# Altium project PCB_One.PrjPCB
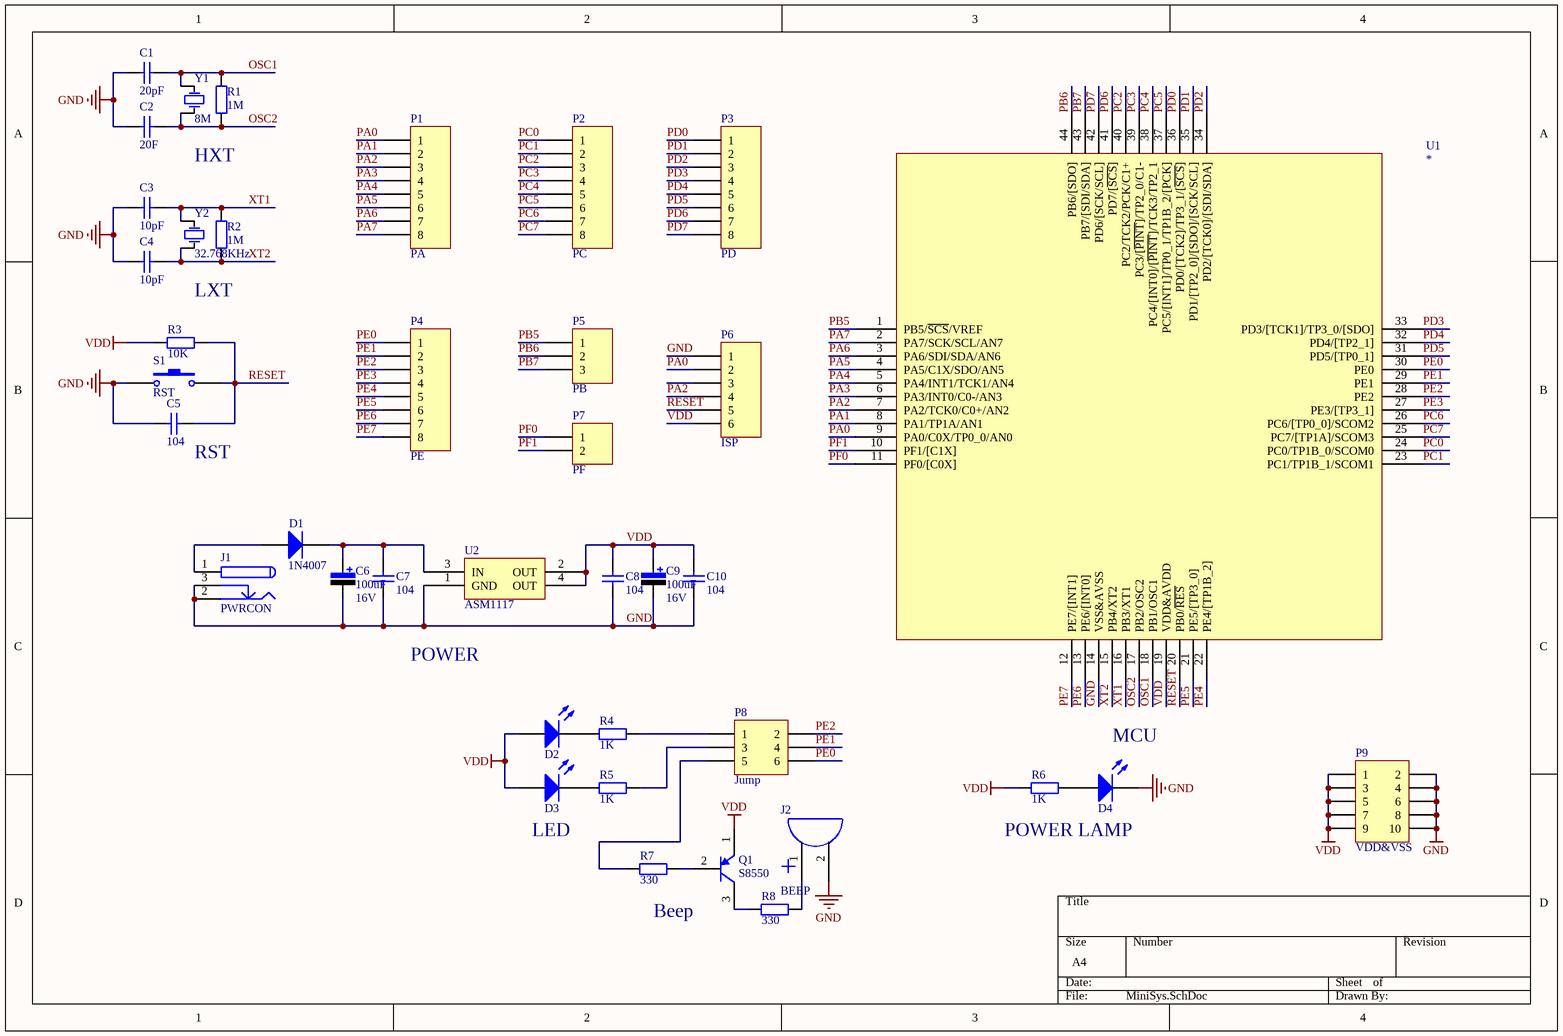
[diagram p0: MiniSys.SchDoc]
1 sheet, 39 parts. Net scope: global (net labels, ports and power ports of the same name join across sheets).
Board file: MiniSys.PcbDoc

## Sheet MiniSys.SchDoc
size A4

### Parts
C1  value 20pF  [C-RAD-0805]  (hidden comment: Cap)
C2  value 20F  [C-RAD-0805]  (hidden comment: Cap)
C3  value 10pF  [C-RAD-0805]  (hidden comment: Cap)
C4  value 10pF  [C-RAD-0805]  (hidden comment: Cap)
C5  value 104  [C-RAD-0805]  (hidden comment: Cap)
C6  value 100uF  Vol: 16V  [RB.1/.2]  (hidden comment: Cap Pol)
C7  value 104  [C-RAD-0805]  (hidden comment: Cap)
C8  value 104  [C-RAD-0805]  (hidden comment: Cap)
C9  value 100uF  Vol: 16V  [RB.1/.2]  (hidden comment: Cap Pol)
C10  value 104  [C-RAD-0805]  (hidden comment: Cap)
D1  Type: 1N4007  [DIODE-AXL]  (hidden comment: Diode)
D2  LED0  [LED_0805]  (value not drawn)
D3  LED0  [LED_0805]  (value not drawn)
D4  LED0  [LED_0805]  (value not drawn)
J1  PWRCON  [DC-005]
J2  BEEP  [Beep]
P1  PA  [HDR1X8]
P2  PC  [HDR1X8]
P3  PD  [HDR1X8]
P4  PE  [HDR1X8]
P5  PB  [HDR3X1_A]
P6  ISP  [HDR1X6]
P7  PF  [HDR2X1_A]
P8  Jump  [HDR2X3]
P9  VDD&VSS  [HDR5X2_A1]
Q1  S8550  [TO-92A]
R1  value 1M  [0805-1]  (hidden comment: Res1)
R2  value 1M  [0805-1]  (hidden comment: Res1)
R3  value 10K  [0805-1]  (hidden comment: Res1)
R4  value 1K  [0805-1]  (hidden comment: Res1)
R5  value 1K  [0805-1]  (hidden comment: Res1)
R6  value 1K  [0805-1]  (hidden comment: Res1)
R7  value 330  [0805-1]  (hidden comment: Res1)
R8  value 330  [0805-1]  (hidden comment: Res1)
S1  RST  [BUTTON]
U1  *
U2  ASM1117  [SOT-223]
Y1  value 8M  [X-HC49U]  (hidden comment: XTAL)
Y2  value 32.768KHz  [X-TC15]  (hidden comment: XTAL)

### Nets
GND: C1.2 C2.2 C3.2 C4.2 C5.1 C6.2 C7.1 C8.1 C9.2 C10.1 D4.2(K) J1.2 J1.3 J2.2 P6.1 P9.2 P9.4 P9.6 P9.8 P9.10 S1.1 U1.14(VSS&AVSS) U2.1(GND)
VDD: C8.2 C9.1 C10.2 D2.1(A) D3.1(A) P6.6 P9.1 P9.3 P9.5 P9.7 P9.9 Q1.1(E) R3.1 R6.1 U1.19(VDD&AVDD) U2.2(OUT) U2.4(OUT)
OSC1: C1.1 R1.1 U1.18(PB1/OSC1) Y1.1(OSC1)
OSC2: C2.1 R1.2 U1.17(PB2/OSC2) Y1.2(OSC2)
PA0: P1.1 P6.2 U1.9(PA0/C0X/TP0_0/AN0)
PA1: P1.2 U1.8(PA1/TP1A/AN1)
PA2: P1.3 P6.4 U1.7(PA2/TCK0/C0+/AN2)
PA3: P1.4 U1.6(PA3/INT0/C0-/AN3)
PA4: P1.5 U1.5(PA4/INT1/TCK1/AN4)
PA5: P1.6 U1.4(PA5/C1X/SDO/AN5)
PA6: P1.7 U1.3(PA6/SDI/SDA/AN6)
PA7: P1.8 U1.2(PA7/SCK/SCL/AN7)
PB5: P5.1 U1.1(PB5/~{SCS}/VREF)
PB6: P5.2 U1.44(PB6/[SDO])
PB7: P5.3 U1.43(PB7/[SDI/SDA])
PC0: P2.1 U1.24(PC0/TP1B_0/SCOM0)
PC1: P2.2 U1.23(PC1/TP1B_1/SCOM1)
PC2: P2.3 U1.40(PC2/TCK2/PCK/C1+)
PC3: P2.4 U1.39(PC3/[~{PINT}]/TP2_0/C1-)
PC4: P2.5 U1.38(PC4/[INT0]/[~{PINT}]/TCK3/TP2_1)
PC5: P2.6 U1.37(PC5/[INT1]/TP0_1/TP1B_2/[PCK])
PC6: P2.7 U1.26(PC6/[TP0_0]/SCOM2)
PC7: P2.8 U1.25(PC7/[TP1A]/SCOM3)
PD0: P3.1 U1.36(PD0/[TCK2]/TP3_1/[~{SCS}])
PD1: P3.2 U1.35(PD1/[TP2_0]/[SDO]/[SCK/SCL])
PD2: P3.3 U1.34(PD2/[TCK0]/[SDI/SDA])
PD3: P3.4 U1.33(PD3/[TCK1]/TP3_0/[SDO])
PD4: P3.5 U1.32(PD4/[TP2_1])
PD5: P3.6 U1.31(PD5/[TP0_1])
PD6: P3.7 U1.41(PD7/[~{SCS}])
PD7: P3.8 U1.42(PD6/[SCK/SCL])
PE0: P4.1 P8.6 U1.30(PE0)
PE1: P4.2 P8.4 U1.29(PE1)
PE2: P4.3 P8.2 U1.28(PE2)
PE3: P4.4 U1.27(PE3/[TP3_1])
PE4: P4.5 U1.22(PE4/[TP1B_2])
PE5: P4.6 U1.21(PE5/[TP3_0])
PE6: P4.7 U1.13(PE6/[INT0])
PE7: P4.8 U1.12(PE7/[INT1])
PF0: P7.1 U1.11(PF0/[C0X])
PF1: P7.2 U1.10(PF1/[C1X])
RESET: C5.2 P6.5 R3.2 S1.2 U1.20(PB0/~{RES})
XT1: C3.1 R2.1 U1.16(PB3/XT1) Y2.1(OSC1)
XT2: C4.1 R2.2 U1.15(PB4/XT2) Y2.2(OSC2)
NetC6_1: C6.1 C7.2 D1.2(K) U2.3(IN)
NetD1_1: D1.1(A) J1.1
NetD2_2: D2.2(K) R4.1
NetD3_2: D3.2(K) R5.1
NetD4_1: D4.1(A) R6.2
NetJ2_1: J2.1 R8.1
NetP8_1: P8.1 R4.2
NetP8_3: P8.3 R5.2
NetP8_5: P8.5 R7.1
NetQ1_2: Q1.2(B) R7.2
NetQ1_3: Q1.3(C) R8.2

Not connected (* = marked no-connect by the designer): P6 3

### Notes on the sheet
- HXT
- LXT
- (near C5) RST
- POWER
- (near D4) MCU
- LED
- POWER LAMP
- Beep

### Library data of the parts
C1-C5 C7 C8 C10 = Cap: 无极性电容; Published: 8-Jun-2000; LatestRevisionDate: 17-Jul-2002; LatestRevisionNote: Re-released for DXP Platform.; PackageReference: RAD-0.3; Publisher: Altium Limited
C6 C9 = Cap Pol: 极性电解电容; Published: 8-Jun-2000; LatestRevisionDate: 17-Jul-2002; LatestRevisionNote: Re-released for DXP Platform.; PackageReference: RB7.6-15; Publisher: Altium Limited
D1 = Diode: 二极管; Published: 8-Jun-2000; LatestRevisionDate: 17-Jul-2002; LatestRevisionNote: Re-released for DXP Platform.; PackageDocument: Sep-1996; PackageReference: SMC; Publisher: Altium Limited; Code_JEDEC: DO-214-AB
D2-D4 = LED0: 发光二极管; Published: 8-Jun-2000; LatestRevisionDate: 08-Jul-2005; LatestRevisionNote: Mech Layer 1 removed.; PackageReference: LED-0; Publisher: Altium Limited
J1 = PWRCON: 直流电源端子; Published: 17-Dec-2003; DatasheetDocument: 09-May-2002; Publisher: Altium Limited; ComponentLink1Description: Manufacturer Link; ComponentLink1URL: http://domino.kycon.com/internet/Products.html
J2 = BEEP: 蜂鸣器
P1-P4 = Header 8: Header, 8-Pin; LatestRevisionDate: 17-Jul-2002; LatestRevisionNote: Re-released for DXP Platform.; Publisher: Altium Limited
P5 = Header 3: 接插件; LatestRevisionDate: 17-Jul-2002; LatestRevisionNote: Re-released for DXP Platform.; Publisher: Altium Limited
P6 = Header 6: 接插件; LatestRevisionDate: 17-Jul-2002; LatestRevisionNote: Re-released for DXP Platform.; Publisher: Altium Limited
P7 = Header 2: 接插件; LatestRevisionDate: 17-Jul-2002; LatestRevisionNote: Re-released for DXP Platform.; Publisher: Altium Limited
P8 = Header 3X2: Header, 3-Pin, Dual row; LatestRevisionDate: 17-Jul-2002; LatestRevisionNote: Re-released for DXP Platform.; Publisher: Altium Limited
P9 = Header 5X2: 接插件; LatestRevisionDate: 17-Jul-2002; LatestRevisionNote: Re-released for DXP Platform.; Publisher: Altium Limited
Q1 = S8550: PNP三极管; Published: 8-Jun-2000; LatestRevisionDate: 15-Jan-2003; LatestRevisionNote: PCB Footprint 'BCY-W3/D4.7' replaced; DatasheetDocument: 1997; PackageDocument: Sep-1998; PackageReference: TO-92A; Publisher: Altium Limited; Code_JEDEC: TO-92A; ComponentLink1Description: Manufacturer Link; ComponentLink1URL: http://www.fairchildsemi.com/; ComponentLink2Description: Datasheet; ComponentLink2URL: http://www.fairchildsemi.com/ds/2N%2F2N3906.pdf
R1-R8 = Res1: 贴片电阻; Published: 8-Jun-2000; LatestRevisionDate: 17-Jul-2002; LatestRevisionNote: Re-released for DXP Platform.; PackageReference: AXIAL-0.4; Publisher: Altium Limited
S1 = SW-PB: 微动开关; Published: 24-Mar-1999; LatestRevisionDate: 17-Jul-2002; LatestRevisionNote: Re-released for DXP Platform.; PackageReference: SPST-2; Publisher: Altium Limited
U1 = HT66FXXX: HT66F50 LQPF44; Name: *
U2 = ASM1117: 3.3V稳压芯片
Y1 Y2 = XTAL: 晶振; Published: 8-Jun-2000; LatestRevisionDate: 17-Jul-2002; LatestRevisionNote: Re-released for DXP Platform.; PackageReference: R38; Publisher: Altium Limited